# EAGLE design ATX_Power_Distro (EAGLE 6.2)
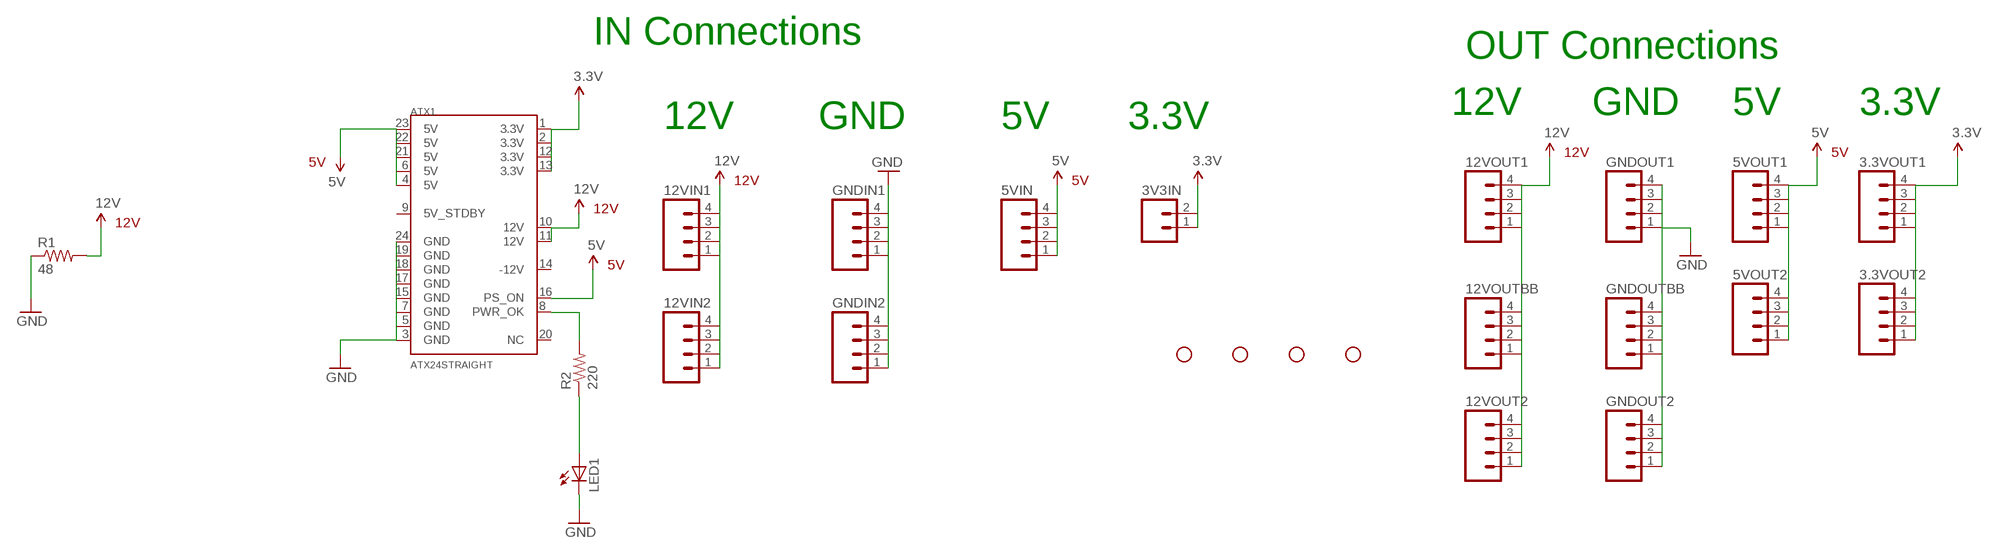
[diagram p0: schematic, sheet 1]

## Parts
3.3VOUT1  M04SCREW-5MM  [SCREWTERMINAL-5MM-4]
3.3VOUT2  M04SCREW-5MM  [SCREWTERMINAL-5MM-4]
3V3IN  M025MM  [SCREWTERMINAL-5MM-2]
5VIN  M04SCREW-5MM  [SCREWTERMINAL-5MM-4]
5VOUT1  M04SCREW-5MM  [SCREWTERMINAL-5MM-4]
5VOUT2  M04SCREW-5MM  [SCREWTERMINAL-5MM-4]
12VIN1  M04SCREW-5MM  [SCREWTERMINAL-5MM-4]
12VIN2  M04SCREW-5MM  [SCREWTERMINAL-5MM-4]
12VOUT1  M04SCREW-5MM  [SCREWTERMINAL-5MM-4]
12VOUT2  M04SCREW-5MM  [SCREWTERMINAL-5MM-4]
12VOUTBB  M04BARRIER_BLOCK_0.375"  [1X04_BARRIER_BLOCK_0.375"]
ATX1  ATX24STRAIGHT  [ATX_24]
GNDIN1  M04SCREW-5MM  [SCREWTERMINAL-5MM-4]
GNDIN2  M04SCREW-5MM  [SCREWTERMINAL-5MM-4]
GNDOUT1  M04SCREW-5MM  [SCREWTERMINAL-5MM-4]
GNDOUT2  M04SCREW-5MM  [SCREWTERMINAL-5MM-4]
GNDOUTBB  M04BARRIER_BLOCK_0.375"  [1X04_BARRIER_BLOCK_0.375"]
JP1  STAND-OFF  [STAND-OFF]
JP2  STAND-OFF  [STAND-OFF]
JP3  STAND-OFF  [STAND-OFF]
JP4  STAND-OFF  [STAND-OFF]
LED1  LED1206  [LED-1206]
R1  48  RESISTORTO-220-15W  [TO220-2PIN]
R2  220  RESISTOR1206  [1206]

## Nets
3.3V: 3.3VOUT1.1 3.3VOUT1.2 3.3VOUT1.3 3.3VOUT1.4 3.3VOUT2.1 3.3VOUT2.2 3.3VOUT2.3 3.3VOUT2.4 3V3IN.1 3V3IN.2 ATX1.1(3.3V) ATX1.2(3.3V) ATX1.12(3.3V) ATX1.13(3.3V)
5V: 5VIN.1 5VIN.2 5VIN.3 5VIN.4 5VOUT1.1 5VOUT1.2 5VOUT1.3 5VOUT1.4 5VOUT2.1 5VOUT2.2 5VOUT2.3 5VOUT2.4 ATX1.4(5V) ATX1.6(5V) ATX1.16(PS_ON) ATX1.21(5V) ATX1.22(5V) ATX1.23(5V)
12V: 12VIN1.1 12VIN1.2 12VIN1.3 12VIN1.4 12VIN2.1 12VIN2.2 12VIN2.3 12VIN2.4 12VOUT1.1 12VOUT1.2 12VOUT1.3 12VOUT1.4 12VOUT2.1 12VOUT2.2 12VOUT2.3 12VOUT2.4 12VOUTBB.1 12VOUTBB.2 12VOUTBB.3 12VOUTBB.4 ATX1.10(12V) ATX1.11(12V) R1.2
GND: ATX1.3(GND) ATX1.5(GND) ATX1.7(GND) ATX1.15(GND) ATX1.17(GND) ATX1.18(GND) ATX1.19(GND) ATX1.24(GND) GNDIN1.1 GNDIN1.2 GNDIN1.3 GNDIN1.4 GNDIN2.1 GNDIN2.2 GNDIN2.3 GNDIN2.4 GNDOUT1.1 GNDOUT1.2 GNDOUT1.3 GNDOUT1.4 GNDOUT2.1 GNDOUT2.2 GNDOUT2.3 GNDOUT2.4 GNDOUTBB.1 GNDOUTBB.2 GNDOUTBB.3 GNDOUTBB.4 LED1.C R1.1
N$9: ATX1.8(PWR_OK) R2.2
N$10: LED1.A R2.1
Unconnected: ATX1.9(5V_STDBY) ATX1.14(-12V) ATX1.20(NC)

## Notes on the sheet
- IN Connections
- OUT Connections
- 12V | GND | 5V | 3.3V
- 12V | GND | 5V | 3.3V

## Library data of the parts
3.3VOUT1 3.3VOUT2 5VIN 5VOUT1 5VOUT2 12VIN1 12VIN2 12VOUT1 12VOUT2 12VOUTBB GNDIN1 GNDIN2 GNDOUT1 GNDOUT2 GNDOUTBB = SparkFun:M04: Header 4 Standard 4-pin 0.1" header. Use with straight break away headers (SKU : PRT-00116), right angle break away headers (PRT-00553), swiss pins (PRT-00743), machine pins (PRT-00117), and female headers (PRT-00115). Molex polarized connector foot print use with SKU : PRT-08231 with associated crimp pins and housings. 1MM SMD Version SKU: PRT-10208
3V3IN = SparkFun:M02: Header 2 Standard 2-pin 0.1" header. Use with straight break away headers (SKU : PRT-00116), right angle break away headers (PRT-00553), swiss pins (PRT-00743), machine pins (PRT-00117), and female headers (PRT-00115). Molex polarized connector foot print use with SKU : PRT-08233 with associated crimp pins and housings.
ATX1 = SparkFun:ATX24: ATX24 Pin Power Supply Connector This is a good connector for connecting a computer power supply to a PCB. It's massive, but provides many amps of power at 5V and 12V. SKU: PRT-09498
JP1-JP4 = SparkFun:STAND-OFF: Stand Off This is the mechanical footprint for a #4 phillips button head screw. Use the keepout ring to avoid running the screw head into surrounding components. SKU : PRT-00447
LED1 = SparkFun:LED: LEDs Standard schematic elements and footprints for 5mm, 3mm, 1206, and 0603 sized LEDs. 5mm - Spark Fun Electronics SKU : COM-00529 (and others)
R1 R2 = SparkFun:RESISTOR: Resistor Basic schematic elements and footprints for 0603, 1206, and PTH resistors.

## Board
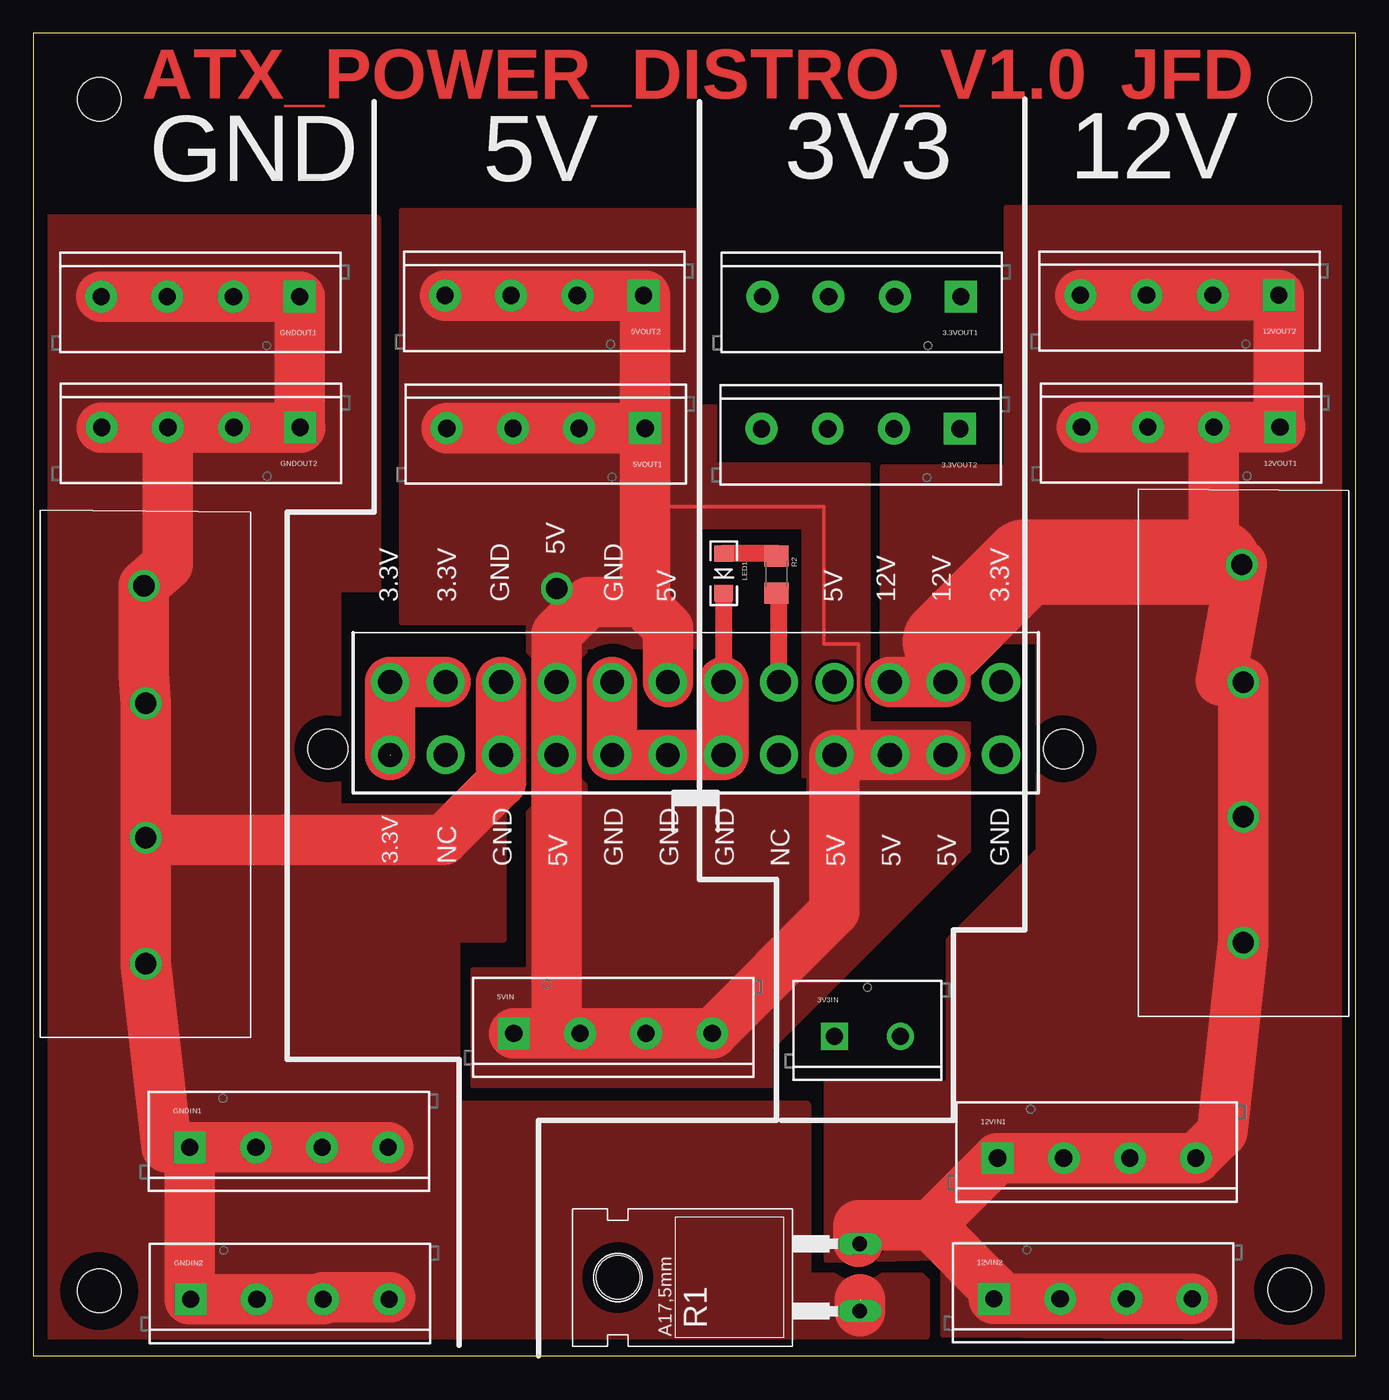
[diagram p1: board, top side]
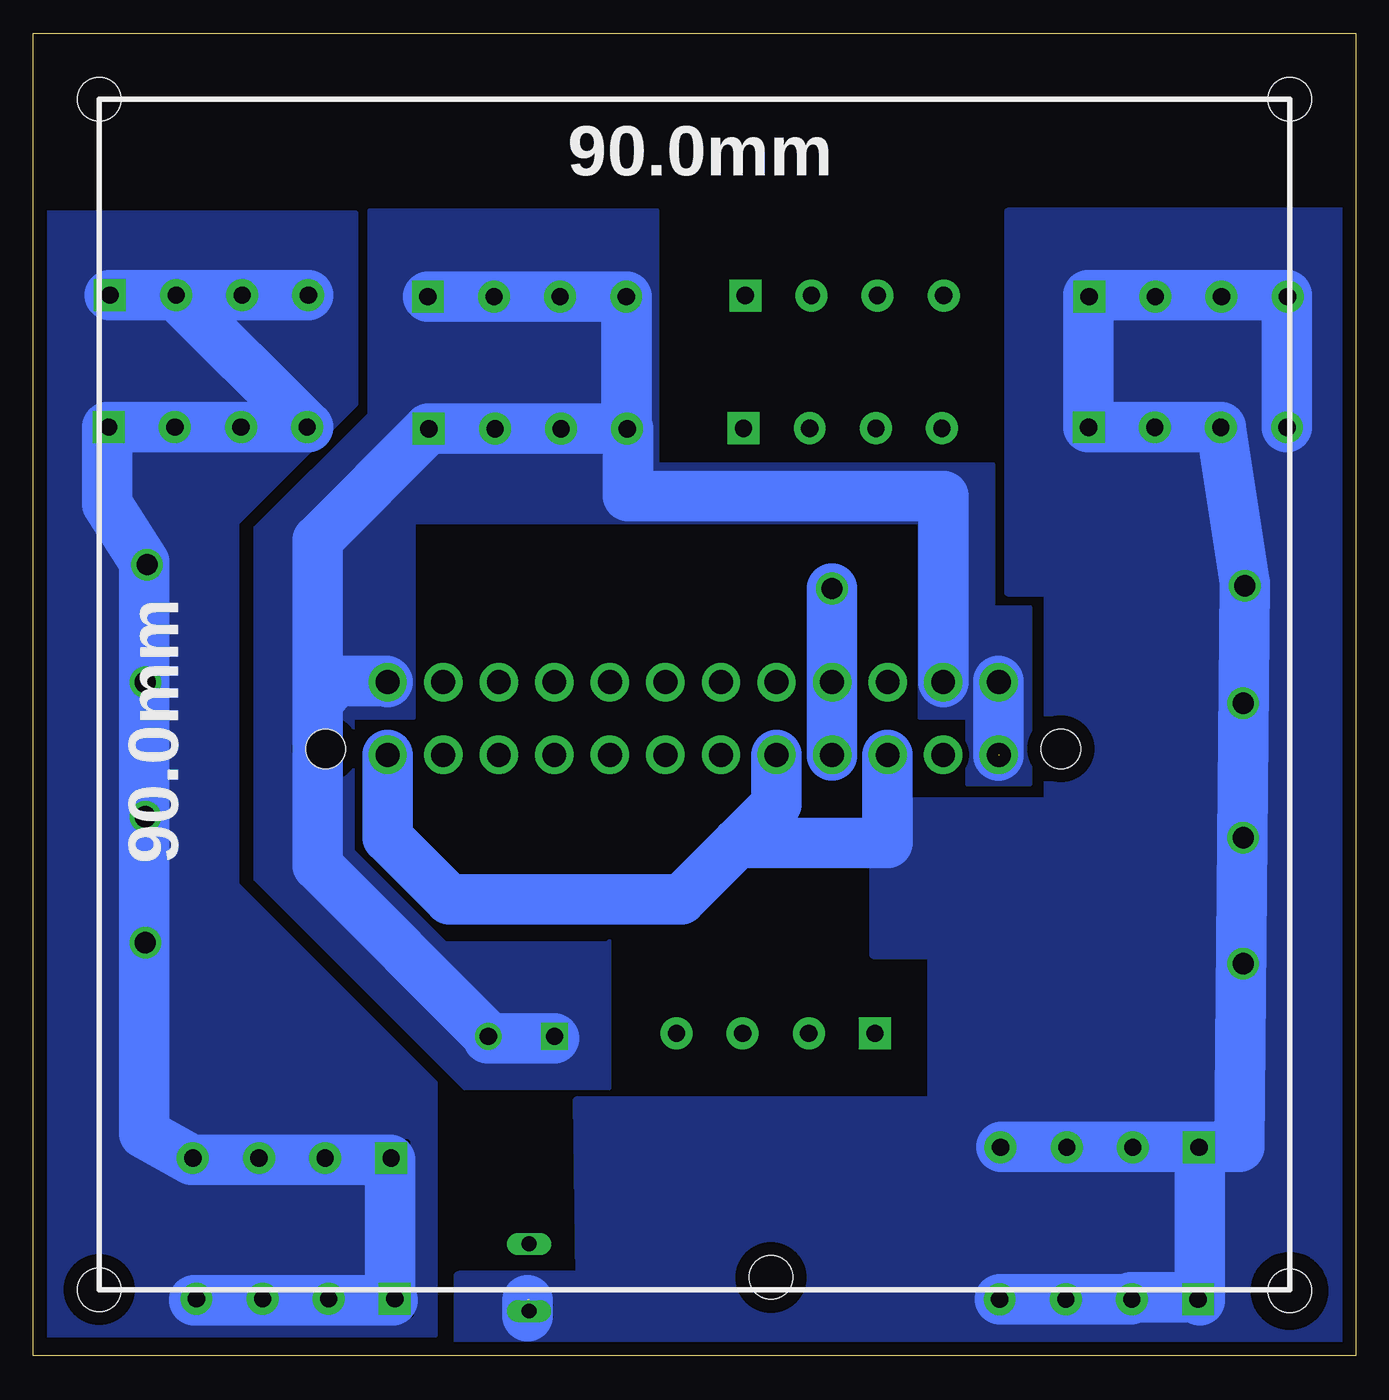
[diagram p2: board, bottom side, seen from below]

Size 100 x 100 mm. Coordinates in mm from the lower left corner, seen from the top.
Outline: 0,0 100,0 100,100 0,100 0,0
Copper layers (1*16): Top 0.035mm / dielectric 1.5mm / Bottom 0.035mm
Design rules: minimum track width 10mil, minimum drill 24mil, track to track 8mil, track to pad 8mil, pad to pad 8mil, via to via 8mil, smd to smd 8mil, copper to edge 40mil, drill to drill 8mil, minimum pad ring 10mil, minimum via ring 8mil, stop-mask expansion 4mil, vias tented up to drill 0mil, thermal gap 10mil

### Footprints (pad centres in the part's own frame; a part is rotated, then mirrored left to right if it is on the bottom)
SCREWTERMINAL-5MM-4 = drill 1.3 pad 2.413 square: 1 3.81,3.81 | drill 1.3 pad 2.413: 2 8.81,3.81; 3 13.81,3.81; 4 18.81,3.81
SCREWTERMINAL-5MM-2 = drill 1.3 pad 2.032 square: 1 0,0 | drill 1.3 pad 2.032: 2 5,0
1X04_BARRIER_BLOCK_0.375" = drill 1.6: 1 0,0; 2 9.525,0; 3 19.685,0; 4 28.575,0.127
ATX_24 = drill 1.8 pad 2.9: 1 -24.1,10.26; 2 -19.9,10.26; 3 -15.7,10.26; 4 -11.5,10.26; 5 -7.3,10.26; 6 -3.1,10.26; 7 1.1,10.26; 8 5.3,10.26; 9 9.5,10.26; 10 13.7,10.26; 11 17.9,10.26; 12 22.1,10.26; 13 -24.1,4.76; 14 -19.9,4.76; 15 -15.7,4.76; 16 -11.5,4.76; 17 -7.3,4.76; 18 -3.1,4.76; 19 1.1,4.76; 20 5.3,4.76; 21 9.5,4.76; 22 13.7,4.76; 23 17.9,4.76; 24 22.1,4.76 | hole 3: -28.8,5.22; 26.8,5.22
STAND-OFF = hole 3.302: 0,0
LED-1206 = smd 1.2 x 1.4: A -1.5,0; C 1.5,0
TO220-2PIN = drill 1.118 long: 1 -3.048,-9.398; 2 2.032,-9.398 | hole 3.302: -0.508,8.89
1206 = smd 1.6 x 1.8: 1 -1.4,0; 2 1.4,0

### Placement (x,y rotation side)
3.3VOUT1  73.96,83.89 180 top
3.3VOUT2  73.89,73.89 180 top
3V3IN  60.58,24.15 0 top
5VIN  32.54,20.57 0 top
5VOUT1  50.09,73.93 180 top
5VOUT2  49.96,83.97 180 top
12VIN1  69.11,11.13 0 top
12VIN2  68.84,0.49 0 top
12VOUT1  98.09,74.01 180 top
12VOUT2  98,84 180 top
12VOUTBB  91.51,31.23 90 top
ATX1  51.09,40.67 0 top
GNDIN1  8.04,11.95 0 top
GNDIN2  8.11,0.45 0 top
GNDOUT1  23.96,83.89 180 top
GNDOUT2  24,74 180 top
GNDOUTBB  8.51,29.64 90 top
JP1  5,4.9 0 top
JP2  95,5 0 top
JP3  5,95 0 top
JP4  95,95 0 top
LED1  52.21,59.15 270 top
R1  53.1,6.42 90 top
R2  56.21,59.07 270 top

### Tracks (layer width: path | path; a pad name or v marks a point on that pad's centre or on a via)
3.3V  (1 unrouted)
  Top 3.81: ATX1.13 ATX1.1 ATX1.2
  Bottom 3.81: 78.5,49.5 78.5,37.07 3V3IN.2 65.58,24 60.6,24 | 78.5,49.5 77,51 73.26,51 ATX1.12 | 78.5,49.5 78.5,61.66 3.3VOUT2.1 3.3VOUT2.2 3.3VOUT2.3 3.3VOUT2.4 | 3.3VOUT2.4 55.15,70.15 3.3VOUT1.4 3.3VOUT1.3 3.3VOUT1.2 3.3VOUT1.1 | ATX1.2 31.19,65 55,65 55,70.08 3.3VOUT2.4 | 27,45.4 27,51
  pour Bottom (isolate 0.5): 56.4,31.4 56.4,20.2 62.8,20.2 67.4,20.2 83.2,36 83.2,62.6 74.6,71.2 74.6,86.6 52.8,86.6 52.8,67.4 27.4,67.4 27.4,56.6 24.6,56.6 24.6,43.2 29.4,43.2 29.4,48.2 33,48.2 33,63 71.2,63 71.2,48.2 75.8,48.2 75.8,43.8 75.8,38.2 68.8,31.2 56.6,31.2
5V  (via drill 1.6)
  Top 0.254: 46.4,70.2 46.4,64.2 59.8,64.2 59.8,53.8 62.4,53.8 62.4,45.4 60.6,45.4
  Top 3.81: 5VIN.1 39.5,24.38 | 39.5,24.38 5VIN.2 5VIN.3 5VIN.4 60.59,33.62 ATX1.21 ATX1.22 ATX1.23 | 39.5,24.38 39.59,24.47 ATX1.16 ATX1.4 39.59,54.59 42,57 46,57 | 46,57 48,55 ATX1.6 | 5VOUT1.4 5VOUT1.3 5VOUT1.2 5VOUT1.1 | 5VOUT1.1 46.28,80.16 5VOUT2.1 5VOUT2.2 5VOUT2.3 5VOUT2.4 | 5VOUT1.1 46.28,57 46,57
  Bottom 3.81: 39.6,45.4 v39.6,58
  pour Top (isolate 1): 33.4,20.4 55.8,20.4 55.8,23.2 70.8,38.2 70.8,47.8 58.6,47.8 58.6,42.4 41.8,42.4 41.8,53.6 50.4,53.6 50.4,86.6 27.8,86.6 27.8,55.4 37.4,55.4 37.4,29.2 33.2,29.2 33.2,20.4
  pour Top (isolate 0.25): 58.2,43.8 58.2,62.6 44.8,62.6 44.8,71.8 51.6,71.8 51.6,67.4 63.2,67.4 63.2,43.8
12V
  Top 3.81: 67.83,9.85 12VIN1.1 12VIN1.2 12VIN1.3 12VIN1.4 89.91,16.93 12VOUTBB.1 12VOUTBB.2 12VOUTBB.3 89.78,51.04 12VOUTBB.4 | 67.83,9.85 72.65,5.03 12VIN2.1 12VIN2.2 12VIN2.3 12VIN2.4 | 12VOUTBB.4 89.28,60.31 12VOUT1.2 | 12VOUT1.4 12VOUT1.3 12VOUT1.2 | 12VOUT1.2 12VOUT1.1 94.19,70.29 12VOUT2.1 12VOUT2.2 12VOUT2.3 12VOUT2.4 | ATX1.10 ATX1.11 68.99,53.99 | 89.59,60 12VOUTBB.4 | 67.83,9.85 62.4,9.85 62.4,8.6
  Top 6.452: 68.99,53.99 75,60 89.59,60
  Bottom 3.81: 12VOUT2.4 12VOUT2.2 | 12VOUT2.1 12VOUT2.2 | 12VOUT2.2 79.2,70.2 94.4,70.2 94.4,64.4 91.6,60 91.6,16.8 88,14.8 73,14.8 73,4.4 72.8,4.2 87.8,4.2
  pour Top (isolate 0.5): 73.6,86.8 73.6,67.2 64.2,67.2 64.2,50.2 70.6,50.2 70.6,54 76,54 76,38.2 69.2,31.4 69.2,20.6 60,20.6 60,7.2 68.8,7.4 68.8,1.6 99,1.4 99,86.8
  pour Bottom (isolate 0.5): 75.6,86.4 75.6,72 84.6,63 84.6,35.6 69.6,20.6 69.6,1.6 99.2,1.6 99.2,86.4
GND  (1 unrouted)
  Top 1.27: LED1.C 52.21,50.93 ATX1.7
  Top 3.81: GNDIN1.4 GNDIN1.3 GNDIN1.2 GNDIN1.1 | GNDOUTBB.2 GNDOUTBB.1 10.11,15.76 GNDIN1.1 | GNDOUTBB.2 GNDOUTBB.3 8.38,51.52 GNDOUTBB.4 10.19,59.81 GNDOUT2.3 | GNDOUT2.4 GNDOUT2.3 | GNDOUT2.3 GNDOUT2.2 GNDOUT2.1 20.15,70.19 GNDOUT1.1 GNDOUT1.2 GNDOUT1.3 GNDOUT1.4 | GNDIN1.1 11.85,4.26 GNDIN2.1 GNDIN2.2 GNDIN2.3 21.92,4.4 27,4.4 | 62.5,4.26 R1.1 | ATX1.15 ATX1.3 35.39,43.39 31,39 10.35,39 GNDOUTBB.2 | ATX1.5 ATX1.17 ATX1.18 ATX1.19 ATX1.7
  Bottom 3.81: ATX1.24 73.19,39.19 68.5,34.5 51,34.5 46.75,38.75 | 46.75,38.75 43.79,41.71 ATX1.17 | ATX1.15 35.39,38.75 46.75,38.75 | 11.8,4.4 17,4.4 17,4.26 GNDIN2.4 | 11.8,4.4 11.8,4.2 | 11.8,4.4 11.8,15.8 | 11.8,15.8 26.8,15.8 | 11.8,15.8 8.8,15.8 8.4,58.4 GNDOUT2.3 GNDOUT2.1 20.2,80.2 5.2,80.2 GNDOUT2.4 | 62.6,3 62.6,4.2
  pour Top (isolate 1): 67.5,1.5 1,1.5 1,86 26,86 26,58 23,58 23,41.5 35.5,41.5 35.5,31.5 32,31.5 32,19 58.5,19 58.5,6 67.5,6
  pour Bottom (isolate 1): 1,86.4 26.2,86.4 26.2,57.8 23.2,57.8 23.2,41.8 36.4,41.8 36.4,30.4 32,30.4 32,19.2 58.8,19.2 58.6,6 67.8,6 67.8,1 1,1
N$9
  Top 1.27: ATX1.8 56.39,57.67 R2.2
N$10
  Top 1.27: R2.1 56.21,60.65 LED1.A

### Text on the board
Top: ATX_POWER_DISTRO_V1.0 | JFD
tPlace: GND | 5V | 3V3 | 12V | 5V | 3.3V | 3.3V | GND | GND | 5V | 5V | 12V | 12V | 3.3V | 3.3V | NC | GND | 5V | GND | GND | GND | NC | 5V | 5V | 5V | GND
bPlace: 90.0mm | 90.0mm